# Altium schematic sheet ACTUATOR_PWR_PROT.SchDoc
size B; SheetNumber: 7; SheetTotal: 7
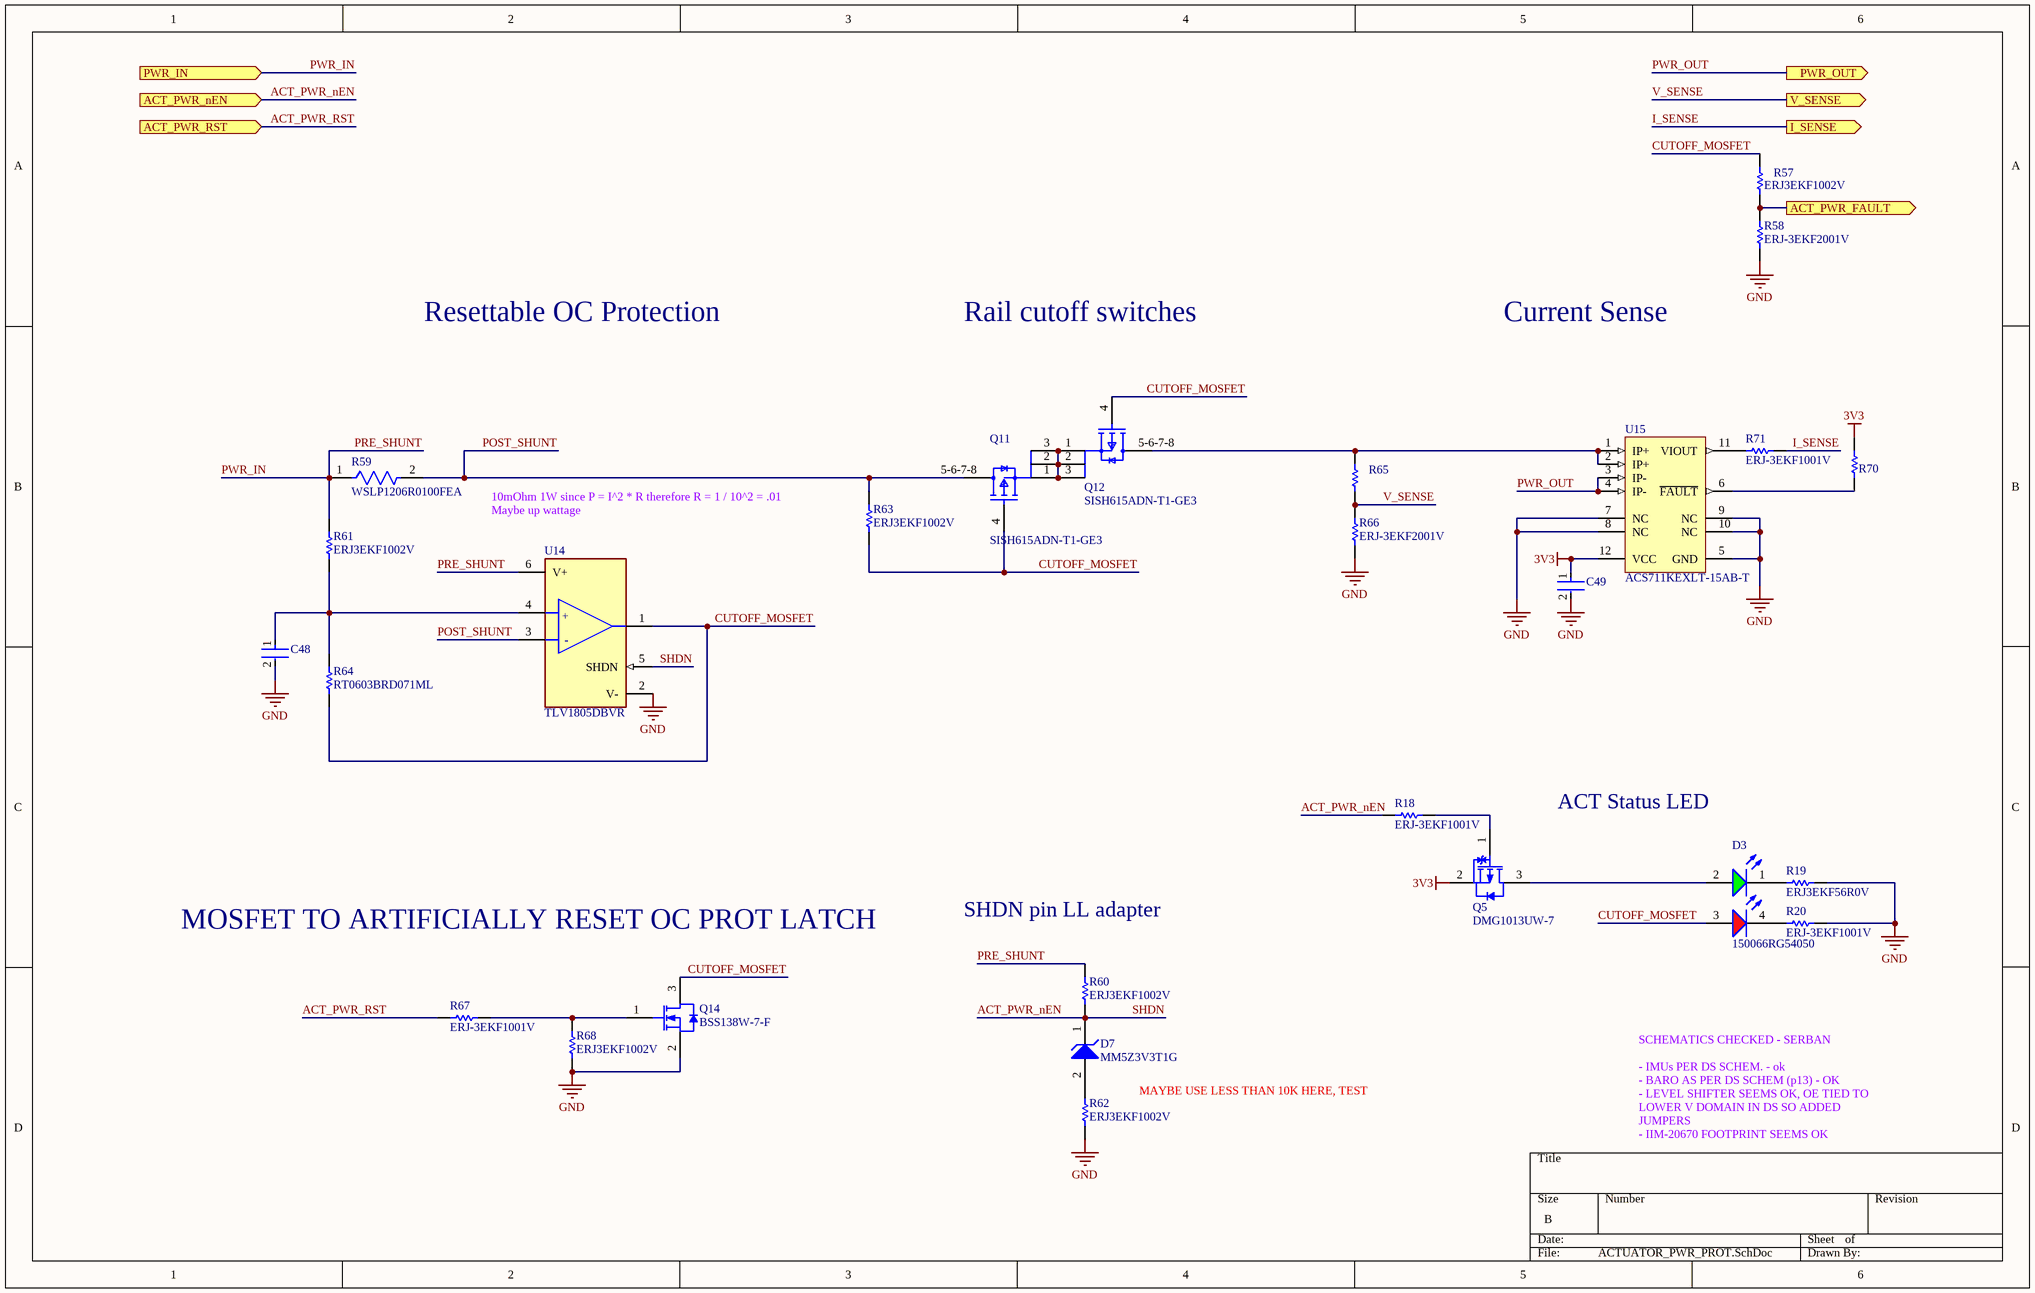
[diagram p0: ACTUATOR_PWR_PROT.SchDoc]

## Parts
C48  GRM188R71H104KA93D  [FP-0402-L_1_0_0_05-W_0_5-IPC_A]  (value not drawn)
C49  GRM188R71H104KA93D  [FP-0402-L_1_0_0_05-W_0_5-IPC_A]  (value not drawn)
D3  150066RG54050  [WL-SBCD_0606]
D7  MM5Z3V3T1G  [ONSC-SOD-523-2-502-01_V]
Q5  DMG1013UW-7  [DIOD-SOT323-3_V]
Q11  SISH615ADN-T1-GE3  [SISH615ADN-T1-GE3-Footprint-1]
Q12  SISH615ADN-T1-GE3  [SISH615ADN-T1-GE3-Footprint-1]
Q14  BSS138W-7-F  [DIOD-SOT323-3_V]
R18  ERJ-3EKF1001V  [RESC1608X55X30LL15T15]
R19  ERJ3EKF56R0V  [RESC1608X55X30NL15T15]
R20  ERJ-3EKF1001V  [RESC1608X55X30LL15T15]
R57  ERJ3EKF1002V  [RESC1609X55X30LL15T15]
R58  ERJ-3EKF2001V  [RESC1608X55X30ML15T15]
R59  WSLP1206R0100FEA  [FP-WSLP1206-FP_1_65x1_93x-MFG]
R60  ERJ3EKF1002V  [RESC1609X55X30LL15T15]
R61  ERJ3EKF1002V  [RESC1609X55X30LL15T15]
R62  ERJ3EKF1002V  [RESC1609X55X30LL15T15]
R63  ERJ3EKF1002V  [RESC1609X55X30LL15T15]
R64  RT0603BRD071ML  [RESC1608X55X30NL20T20]
R65  ERJ3EKF1002V  [RESC1609X55X30LL15T15]  (value not drawn)
R66  ERJ-3EKF2001V  [RESC1608X55X30ML15T15]
R67  ERJ-3EKF1001V  [RESC1608X55X30LL15T15]
R68  ERJ3EKF1002V  [RESC1609X55X30LL15T15]
R70  ERJ3EKF1002V  [RESC1609X55X30LL15T15]  (value not drawn)
R71  ERJ-3EKF1001V  [RESC1608X55X30LL15T15]
U14  TLV1805DBVR  [FP-DBV0006A-IPC_C]
U15  ACS711KEXLT-15AB-T  [ALEG-EX-12_V]

## Ports
ACT_PWR_FAULT (out, see HYDRA_V3_NAV[3B], STM32H730_PINOUT[8A]), ACT_PWR_nEN (in), ACT_PWR_RST (in), I_SENSE (out, see HYDRA_V3_NAV[3B], STM32H730_PINOUT[8A]), PWR_IN (in, see HYDRA_V3_NAV[3A]), PWR_OUT (out, see HYDRA_V3_NAV[3B]), V_SENSE (out, see HYDRA_V3_NAV[3B], STM32H730_PINOUT[8A])

## Nets
3V3: C49.1 Q5.2(S) R70.2 U15.12(VCC)
GND: C48.2 C49.2 Q14.2(S) R19.1 R20.2 R58.1 R62.1 R66.1 R68.1 U14.2(V-) U15.5(GND) U15.7(NC) U15.8(NC) U15.9(NC) U15.10(NC)
ACT_PWR_FAULT: R57.2 R58.2 ; port ACT_PWR_FAULT
ACT_PWR_nEN: D7.1(K) R18.1 R60.1 U14.5(SHDN) ; port ACT_PWR_nEN  [also labelled SHDN]
ACT_PWR_RST: R67.2 ; port ACT_PWR_RST
CUTOFF_MOSFET: D3.3(A) Q11.4(G) Q12.4(G) Q14.3(D) R57.1 R63.1 R64.1 U14.1(OUT)
I_SENSE: R71.2 ; port I_SENSE
POST_SHUNT: Q11.5-6-7-8(D) R59.2 R63.2 U14.3(-IN)
PRE_SHUNT: R59.1 R60.2 R61.2 U14.6(V+) ; port PWR_IN  [also labelled PWR_IN]
PWR_OUT: U15.3(IP-) U15.4(IP-) ; port PWR_OUT
V_SENSE: R65.2 R66.2 ; port V_SENSE
NetC48_1: C48.1 R61.1 R64.2 U14.4(+IN)
NetD3_1: D3.1(K) R19.2
NetD3_2: D3.2(A) Q5.3(D)
NetD3_4: D3.4(K) R20.1
NetD7_2: D7.2(A) R62.2
NetQ5_1: Q5.1(G) R18.2
NetQ11_1: Q11.1(S) Q11.2(S) Q11.3(S) Q12.1(S) Q12.2(S) Q12.3(S)
NetQ12_5-6-7-8: Q12.5-6-7-8(D) R65.1 U15.1(IP+) U15.2(IP+)
NetQ14_1: Q14.1(G) R67.1 R68.2
NetR70_1: R70.1 U15.6(~{FAULT})
NetR71_1: R71.1 U15.11(VIOUT)

## Notes on the sheet
- Resettable OC Protection
- Rail cutoff switches
- Current Sense
- (near R63) 10mOhm 1W since P = I^2 * R therefore R = 1 / 10^2 = .01
- Maybe up wattage
- ACT Status LED
- MOSFET TO ARTIFICIALLY RESET OC PROT LATCH
- SHDN pin LL adapter
- MAYBE USE LESS THAN 10K HERE, TEST
- SCHEMATICS CHECKED - SERBAN
  - IMUs PER DS SCHEM. - ok
  - BARO AS PER DS SCHEM (p13) - OK
  - LEVEL SHIFTER SEEMS OK, OE TIED TO LOWER V DOMAIN IN DS SO ADDED JUMPERS
  - IIM-20670 FOOTPRINT SEEMS OK
- (in symbol CMP-04896-000098-1) +; -

## Library data of the parts
C48 C49 = CMP-001-00058-1: LARGE PADS, 0402 CAP, CHANGE COMMENT TO MATCH REAL P/N; Capacitor Type: Ceramic; Min Operating Temperature: -55°C; Mounting Technology: Surface Mount; Pins: 2; Case/Package: 0402; RoHS Compliant: Yes; Max Operating Temperature: 85°C
D3 = CMP-004-00034-2: Led, Red/Grn, 180Mcd/230Mcd, 624Nm/525Nm Rohs Compliant: Yes
D7 = CMP-1060-00750-1: Zener Voltage Regulator, 500 mW, 2-Pin SOD-523, Pb-Free, Tape and Reel; Manufacturer: On Semiconductor; P Max (W): 0.5; VZ Typ (V): 3.3; RoHS: Pb-Free; ComponentLink2Description: Datasheet; PackageReference: SOD-523-2-502-01; DatasheetVersion: Rev. 10; ComponentLink1Description: Manufacturer URL; PackageVersion: Rev. E, 09/2010; ComponentLink3URL: http://www.onsemi.com/pub_link/Collateral/502-01.PDF; ComponentLink2URL: http://www.onsemi.cn/pub_link/Collateral/MM5Z2V4T1-D.PDF; Mounting Technology: Surface Mount; PartNumber: MM5Z3V3T1G; Packing: Tape and Reel; PackageDescription: 2-Pin SOD, Body 1.2 x 0.8 mm; ComponentLink1URL: http://www.onsemi.com/; ComponentLink3Description: Package Specification
Q5 = CMP-2000-06170-1: P-Channel Enhancement Mode MOSFET, 310 mW, 20 V, -55 to 150 degC, 3-Pin SOT-323, RoHS, Tape and Reel; Manufacturer: Diodes Inc; Qg Gate Charge: 0.622nC; Drain-Source On Resistance-Max: 750mO; Rated Power Dissipation: 310mW; Drain-to-Source Voltage [Vdss]: 20V; Package Reference: SOT323; Datasheet Version: Rev. 3-2, 09/2013; Package Description: 3-Pin Small Outline Transistor, Body 2 x 1.25 mm, Pitch 0.65 mm; Mounting Technology: SurfaceMount; Manufacturer URL: http://www.diodes.com/; Datasheet URL: http://www.diodes.com/_files/datasheets/ds31861.pdf; Channel Type: P-Channel
Q11 Q12 = CMP-013-00018-2: Trans MOSFET P-CH 20V 22.1A 8-Pin PowerPAK 1212 EP T/R; Source: SISH615ADN-T1-GE3.SchLib; Design Item ID: CMP-013-00036-4; Component Type: Standard; Pins: 5
Q14 = CMP-2000-05968-1: N-Channel Enhancement Mode Mosfet, 50 V, 200 mA, -55 to 150 degC, 6-Pin SOT-323, RoHS, Tape and Reel; Typical Turn-Off Delay Time: 20ns; Number of Channels: 1Channel; Type: EnhancementModeFieldEffectTransistor; Brand: DiodesIncorporated; Vds - Drain-Source Breakdown Voltage: 75V; Vgs - Gate-Source Voltage: 20V; Rds On - Drain-Source Resistance: 1.4Ohms; Transistor Type: 1N-Channel; Configuration: Single; Unit Weight: 0.000212oz; Pd - Power Dissipation: 200mW; Id - Continuous Drain Current: 200mA; Forward Transconductance - Min: 0.1S; Manufacturer URL: http://www.diodes.com/; Series: BSS138; Package Description: 3-Pin Small Outline Transistor, Body 2 x 1.25 mm, Pitch 0.65 mm; Mounting Technology: SurfaceMount; Product Category: MOSFET; RoHS: True; Maximum Operating Temperature: +150C; Height: 1mm; Length: 2.2mm; Technology: Si; Width: 1.35mm; Datasheet URL: http://www.diodes.com/_files/datasheets/ds30206.pdf; Manufacturer: DiodesIncorporated; Package / Case: SOT-323-3; Typical Turn-On Delay Time: 20ns; Transistor Polarity: N-Channel; Factory Pack Quantity: 3000; Packaging: Reel; Product: MOSFETSmallSignal; Datasheet Version: Rev. 11-2, 09/2013; Package Reference: SOT323; Minimum Operating Temperature: -55C; Mounting Style: SMD/SMT; Channel Mode: Enhancement
R18 R20 R67 R71 = CMP-2000-00180-1: Manufacturer: Panasonic; Part Number: ERJ-3EKF1001V
R19 = CMP-2000-00572-1: Manufacturer: Panasonic; Part Number: ERJ3EKF56R0V
R57 R60-R63 R65 R68 R70 = CMP-1012-00623-3: Chip Resistor, 10 KOhm, +/- 1%, 0.1 W, -55 to 155 degC, 0603 (1608 Metric), RoHS, Tape and Reel; Manufacturer: Panasonic; Voltage Rating: 75V; Case\/Package: 0603; Power Rating: 100mW; Resistance: 10KOhm; Temperature Coefficient: 100ppm\/degreesC; Number of Pins: 2; Package Reference: 603; Depth: 0.8mm; Mount: SurfaceMount; Package Description: 2-Pin Surface Mount Device, Body 1.6 x 0.85 mm; Datasheet Version: 02/2017; Length: 1.6mm; Lead Free: LeadFree; Height: 0.45mm; Number of Terminations: 2; Max Power Dissipation: 100mW; Min Operating Temperature: -55degC; Datasheet URL: https://industrial.panasonic.com/cdbs/www-data/pdf/RDA0000/AOA0000C304.pdf; Termination: SMD/SMT; Case Code (Metric): 1608; Case Code (Imperial): 0603; Tolerance: 1%; Max Operating Temperature: 155degC; RoHSCompliant: true; Voltage Rating (DC): 75V; Radiation Hardening: No; Packaging: TapeandReel; Composition: ThickFilm; Mounting Technology: SurfaceMount; Manufacturer URL: http://www.panasonic.com/; Width: 0.031inch; REACH SVHC: NoSVHC; Contact Plating: Tin; Military Standard: Not; Package Quantity: 1
R58 R66 = CMP-2000-00317-1: Manufacturer: Panasonic; Part Number: ERJ-3EKF2001V
R59 = CMP-2003-04373-2: RES 0.01 OHM 1% 1W 1206; Temperature Coefficient: 75ppm/°C; Resistance: 10mR; Features: Moisture Resistant; Case/Package: 1206; Military Standard: Not; Case Code (Imperial): 1206; Power Rating: 1W; Number of Terminations: 2; Lead Free: Lead Free; Number of Pins: 2; Min Operating Temperature: -65°C; Weight: 0.000571oz; Radiation Hardening: No; Series: WSLP; Length: 3.2mm; Termination: SMD/SMT; Mount: Surface Mount; Size Code: 1206; Height: 0.035inch; Case Code (Metric): 3216; Resistance Tolerance: 1%; Contact Plating: Tin; Width: 0.063inch; Construction: Rectangular; Packaging: Tape and Reel; Package Quantity: 1; RoHS Compliant: Yes; Depth: 1.6mm; Tolerance: 1%; Max Operating Temperature: 170°C; Max Power Dissipation: 1W; Resistor Type: Metal Strip
R64 = CMP-2000-00925-1: NOT PANASONIC, THIS IS A 1M RESISTORhttps://www.yageo.com/upload/media/product/productsearch/datasheet/rchip/PYu-RT_1-to-0.01_RoHS_L_13.pdf; Part Number: ERA-3AEB163V; Manufacturer: Panasonic
U14 = CMP-04896-000098-1: 40V, RAIL-TO-RAIL INPUT, PUSH-PU
U15 = CMP-1557-00001-1: Hall Effect Linear Current Sensor with Overcurrent Fault Output for <100 V Isolation Applications, 3 to 5.5 V, -15.5 to 15.5 A IP, -40 to 125 degC, 12-Pin QFN (EX), RoHS, Tape and Reel; VCC Max: 5.5 V; IP Max: 15.5 A; VCC Min: 3 V; IP Min: -15.5 A; -3dB Bandwidth: 0.1 MHz; PackageDescription: 12-Pin Quad Flat No-Lead, Body 3 x 3 mm, Height 0.8 mm; ComponentLink1URL: http://www.allegromicro.com/; Packing: Tape and Reel; ComponentLink2URL: http://www.allegromicro.com/~/media/Files/Datasheets/ACS711-Datasheet.ashx?la=en; DatasheetVersion: Rev. 3; PartNumber: ACS711KEXLT-15AB-T; ComponentLink2Description: Datasheet; ComponentLink3URL: http://www.allegromicro.com/~/media/Files/Datasheets/ACS711-Datasheet.ashx?la=en; RoHS: TRUE; ComponentLink1Description: Manufacturer URL; ComponentLink3Description: Package Specification; Temperature Max: 125 degC; Mounting Technology: Surface Mount; Temperature Min: -40 degC